# EAGLE design nanoController (EAGLE 9.6.1)
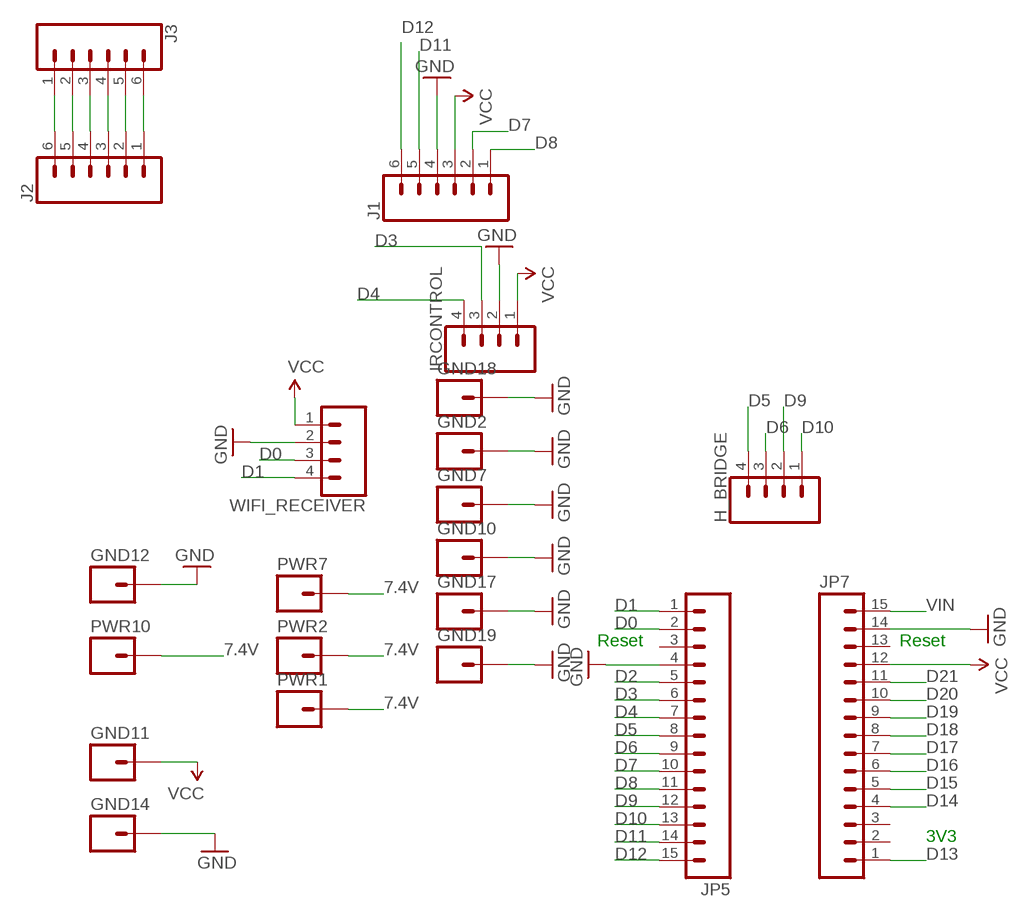
[diagram p0: schematic, sheet 1]

## Parts
GND2  M01PTH_LONGPAD  [1X01_LONGPAD]
GND7  M01PTH_LONGPAD  [1X01_LONGPAD]
GND10  M01PTH_LONGPAD  [1X01_LONGPAD]
GND11  M01PTH_LONGPAD  [1X01_LONGPAD]
GND12  M01PTH_LONGPAD  [1X01_LONGPAD]
GND14  M01PTH_LONGPAD  [1X01_LONGPAD]
GND17  M01PTH_LONGPAD  [1X01_LONGPAD]
GND18  M01PTH_LONGPAD  [1X01_LONGPAD]
GND19  M01PTH_LONGPAD  [1X01_LONGPAD]
H_BRIDGE  CONN_04LONGPADS  [1X04_LONGPADS]
IRCONTROL  CONN_04LONGPADS  [1X04_LONGPADS]
J1  CONN_06SILK_FEMALE_PTH  [1X06]
J2  CONN_06SILK_FEMALE_PTH  [1X06]
J3  CONN_06SILK_FEMALE_PTH  [1X06]
JP5  M15  [1X15]
JP7  M15  [1X15]
PWR1  M01PTH_LONGPAD  [1X01_LONGPAD]
PWR2  M01PTH_LONGPAD  [1X01_LONGPAD]
PWR7  M01PTH_LONGPAD  [1X01_LONGPAD]
PWR10  M01PTH_LONGPAD  [1X01_LONGPAD]
WIFI_RECEIVER  CONN_04LONGPADS  [1X04_LONGPADS]

## Nets
7.4V: PWR1.1 PWR2.1 PWR7.1 PWR10.1
D0: JP5.2 WIFI_RECEIVER.3
D1: JP5.1 WIFI_RECEIVER.4
D2: JP5.5
D3: IRCONTROL.3 JP5.6
D4: IRCONTROL.4 JP5.7
D5: H_BRIDGE.4 JP5.8
D6: H_BRIDGE.3 JP5.9
D7: J1.2 JP5.10
D8: J1.1 JP5.11
D9: H_BRIDGE.2 JP5.12
D10: H_BRIDGE.1 JP5.13
D11: J1.5 JP5.14
D12: J1.6 JP5.15
D13: JP7.1
D14: JP7.4
D15: JP7.5
D16: JP7.6
D17: JP7.7
D18: JP7.8
D19: JP7.9
D20: JP7.10
D21: JP7.11
GND [gnd]: GND2.1 GND7.1 GND10.1 GND12.1 GND14.1 GND17.1 GND18.1 GND19.1 IRCONTROL.2 J1.4 JP5.4 JP7.14 WIFI_RECEIVER.2
N$1: J2.6 J3.1
N$2: J2.5 J3.2
N$3: J2.4 J3.3
N$4: J2.3 J3.4
N$5: J2.2 J3.5
N$6: J2.1 J3.6
VCC: GND11.1 IRCONTROL.1 J1.3 JP7.12 WIFI_RECEIVER.1
VIN: JP7.15
Unconnected: JP5.3 JP7.2 JP7.3 JP7.13

## Notes on the sheet
- Reset | Reset
- 3V3

## Library data of the parts
GND2 GND7 GND10-GND12 GND14 GND17-GND19 PWR1 PWR2 PWR7 PWR10 = SparkFun-Connectors:M01: Header 1 Standard 1-pin 0.1" header. Use with straight break away headers (SKU : PRT-00116), right angle break away headers (PRT-00553), swiss pins (PRT-00743), machine pins (PRT-00117), and female headers (PRT-00115).
H_BRIDGE IRCONTROL WIFI_RECEIVER = SparkFun-Connectors:CONN_04: Multi connection point. Often used as Generic Header-pin footprint for 0.1 inch spaced/style header connections On any of the 0.1 inch spaced packages, you can populate with these: Break Away Headers - Straight <https://www.sparkfun.com/products/116> (PRT-00116) Break Away Male Headers - Right Angle <https://www.sparkfun.com/products/553> (PRT-00553) Female Headers <https://www.sparkfun.com/products/115> (PRT-00115) Break Away Headers - Machine Pin <https://www.sparkfun.com/products/117> (PRT-00117) Break Away Female Headers - Swiss Machine Pin <https://www.sparkfun.com/products/743> (PRT-00743) For SCREWTERMINALS and SPRING TERMINALS visit here: Screw Terimnals on SparkFun.com <https://www.sparkfun.com/search/results?term=Screw+Terminals> (5mm/3.5mm/2.54mm spacing) This device is also useful as a general connection point to wire up your design to another part of your project. Our various solder wires solder well into these plated through hole pads. Hook-Up Wire - Assortment (Stranded, 22 AWG) <https://www.sparkfun.com/products/11375> (PRT-11375) Hook-Up Wire - Assortment (Solid Core, 22 AWG) <https://www.sparkfun.com/products/11367> (PRT-11367) View the entire wire category on our website here <https://www.sparkfun.com/categories/141> Special notes: Molex polarized connector foot print use with SKU : PRT-08231 with associated crimp pins and housings. 1MM SMD Version SKU: PRT-10208; PROD_ID: CONN-09696
J1-J3 = SparkFun-Connectors:CONN_06: Multi connection point. Often used as Generic Header-pin footprint for 0.1 inch spaced/style header connections On any of the 0.1 inch spaced packages, you can populate with these: Break Away Headers - Straight <https://www.sparkfun.com/products/116> (PRT-00116) Break Away Male Headers - Right Angle <https://www.sparkfun.com/products/553> (PRT-00553) Female Headers <https://www.sparkfun.com/products/115> (PRT-00115) Break Away Headers - Machine Pin <https://www.sparkfun.com/products/117> (PRT-00117) Break Away Female Headers - Swiss Machine Pin <https://www.sparkfun.com/products/743> (PRT-00743) Arduino Stackable Header - 6 Pin <https://www.sparkfun.com/products/9280> (PRT-09280) For SCREWTERMINALS and SPRING TERMINALS visit here: Screw Terimnals on SparkFun.com <https://www.sparkfun.com/search/results?term=Screw+Terminals> (5mm/3.5mm/2.54mm spacing) This device is also useful as a general connection point to wire up your design to another part of your project. Our various solder wires solder well into these plated through hole pads. Hook-Up Wire - Assortment (Stranded, 22 AWG) <https://www.sparkfun.com/products/11375> (PRT-11375) Hook-Up Wire - Assortment (Solid Core, 22 AWG) <https://www.sparkfun.com/products/11367> (PRT-11367) View the entire wire category on our website here <https://www.sparkfun.com/categories/141>; PROD_ID: CONN-08437
JP5 JP7 = SparkFun-Connectors:M15: Header 15 Standard 15-pin 0.1" header. Use with straight break away headers (SKU : PRT-00116), right angle break away headers (PRT-00553), swiss pins (PRT-00743), machine pins (PRT-00117), and female headers (PRT-00115).

## Net classes
0 default: width 0.254 mm, clearance 0.254 mm
1 power: width 0.61 mm, drill 0.711 mm, clearance 0.33 mm
2 gnd: width 0.305 mm, drill 0.711 mm, clearance 0.254 mm
3 usbvcc: width 0.508 mm, drill 0.711 mm, clearance 0.254 mm
4 aref: width 0.406 mm

## Board
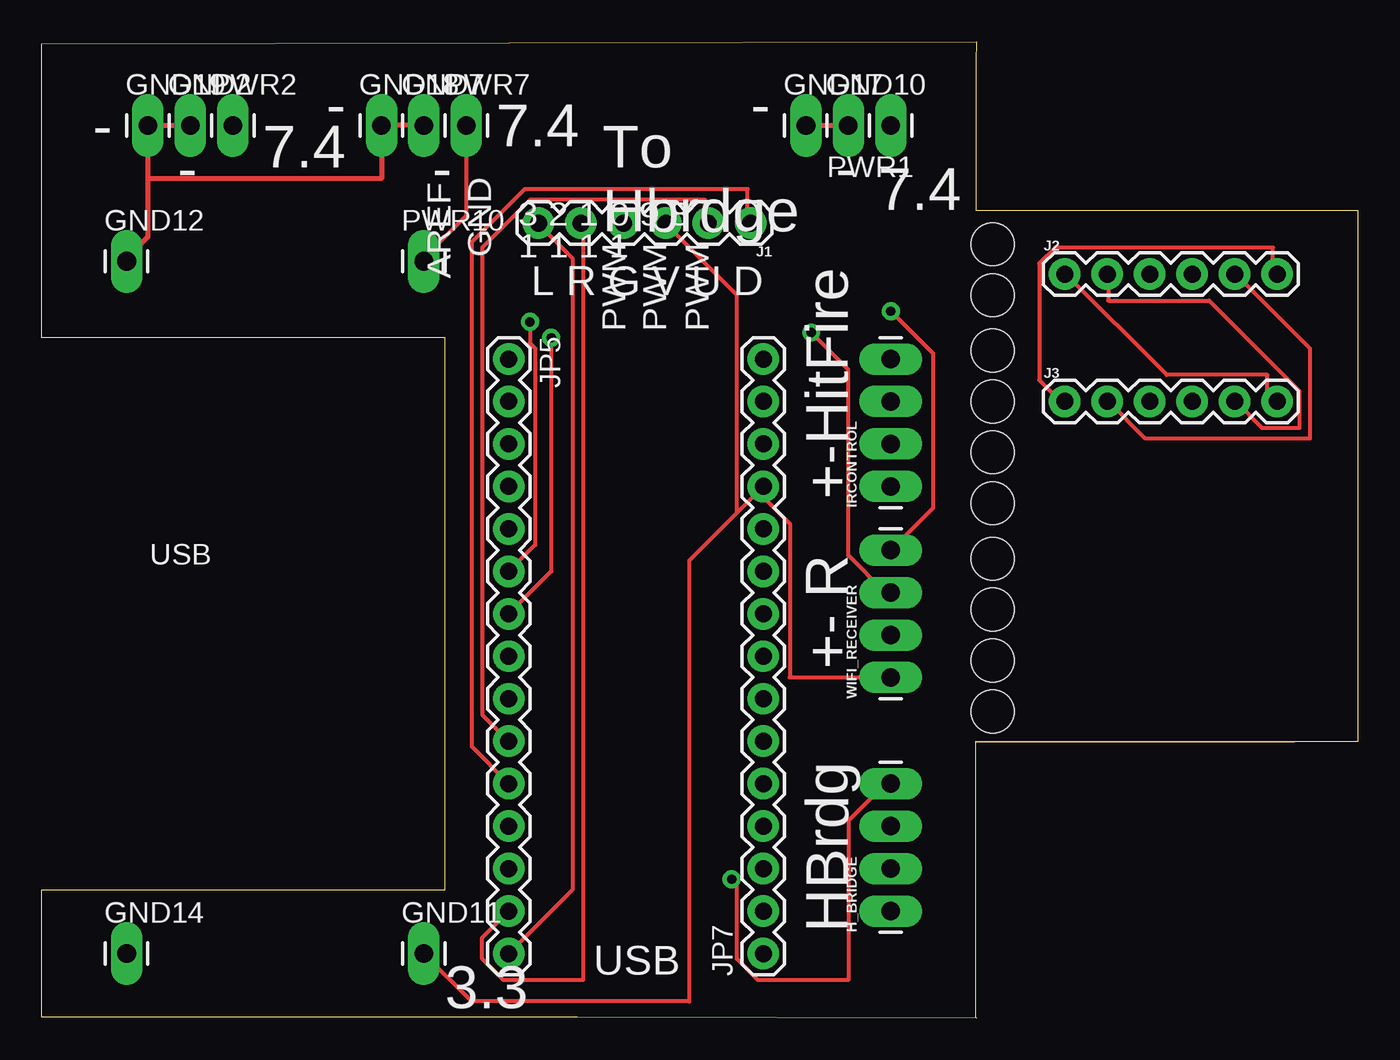
[diagram p1: board, top side]
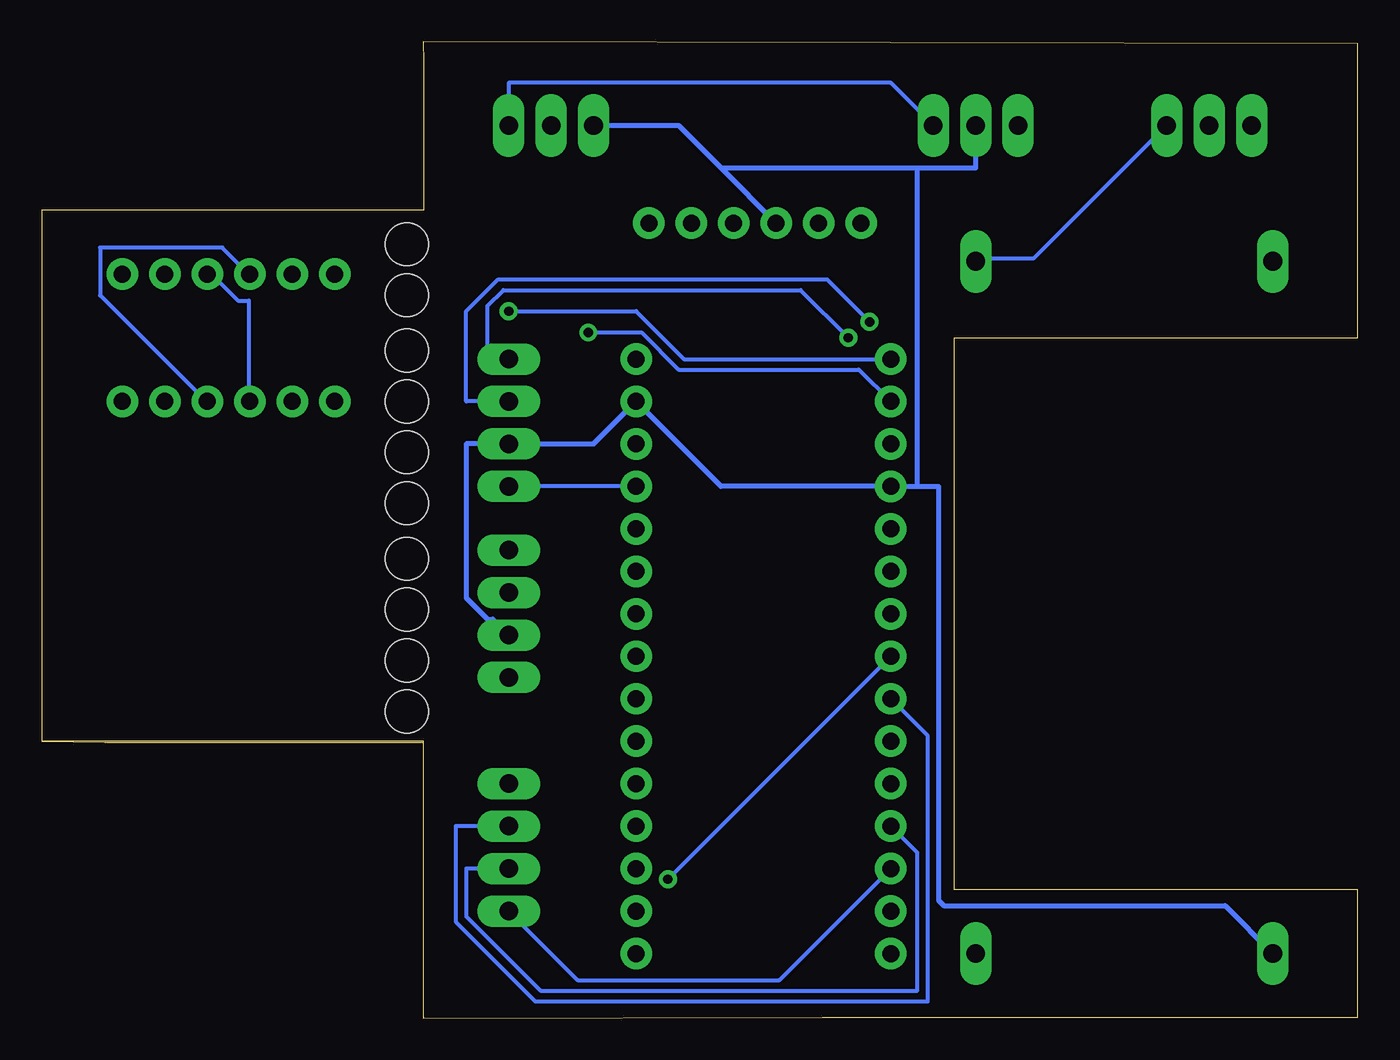
[diagram p2: board, bottom side, seen from below]

Size 78.74 x 58.39 mm. Coordinates in mm from the lower left corner, seen from the top.
Outline: 78.74,16.56 78.74,48.31 55.88,48.31 55.88,57.2 55.93,58.39 0,58.27 0,40.69 24.13,40.69 24.13,7.67 0,7.67 0,0.05 32.03,0.05 55.93,0 55.88,0.05 55.88,16.56
Outline: 55.88,16.56 78.74,16.56
Outline: 78.74,16.56 74.98,16.51 55.93,16.51 55.88,16.56
Copper layers (1*16): Top 0.035mm / dielectric 1.5mm / Bottom 0.035mm
Design rules "default": minimum track width 10mil, minimum drill 22mil, track to track 10mil, track to pad 10mil, pad to pad 10mil, via to via 16mil, smd to smd 8mil, copper to edge 30mil, drill to drill 12mil, minimum pad ring 10mil, minimum via ring 10mil, stop-mask expansion 4mil, vias tented up to drill 0mil, thermal gap 10mil
Holes 2.54 mm at 56.9,46.28 56.9,43.23 56.9,39.93 56.9,36.88 56.9,33.83 56.9,30.78 56.9,27.48 56.9,24.43 56.9,21.39 56.9,18.34
vRestrict: area 25.4,45.5 to 27.1,49.2; area 33.4,41.1 to 34.9,44.6; area 35.9,41.1 to 37.5,44.6; area 38.5,41.1 to 40,44.6; area 42.5,38.7 to 43.1,38.9

### Footprints (pad centres in the part's own frame; a part is rotated, then mirrored left to right if it is on the bottom)
1X01_LONGPAD = drill 1.118 pad 1.88 long: 1 0,0
1X04_LONGPADS = drill 1.118 pad 1.88 long: 1 0,0; 2 2.54,0; 3 5.08,0; 4 7.62,0
1X06 = drill 1.016 pad 1.88: 1 0,0; 2 2.54,0; 3 5.08,0; 4 7.62,0; 5 10.16,0; 6 12.7,0
1X15 = drill 1.016 pad 1.88: 1 0,0; 2 2.54,0; 3 5.08,0; 4 7.62,0; 5 10.16,0; 6 12.7,0; 7 15.24,0; 8 17.78,0; 9 20.32,0; 10 22.86,0; 11 25.4,0; 12 27.94,0; 13 30.48,0; 14 33.02,0; 15 35.56,0

### Placement (x,y rotation side)
GND2  8.89,53.39 0 top
GND7  22.86,53.39 0 top
GND10  48.26,53.39 0 top
GND11  22.86,3.86 0 top
GND12  5.08,45.26 0 top
GND14  5.08,3.86 0 top
GND17  45.72,53.39 0 top
GND18  20.32,53.39 0 top
GND19  6.35,53.39 0 top
H_BRIDGE  50.8,6.4 90 top
IRCONTROL  50.8,31.8 90 top
J1  42.42,47.55 180 top
J2  61.21,44.5 0 top
J3  61.21,36.88 0 top
JP5  27.94,39.42 270 top
JP7  43.18,3.86 90 top
PWR1  50.8,53.39 180 top
PWR2  11.43,53.39 0 top
PWR7  25.4,53.39 0 top
PWR10  22.86,45.26 0 top
WIFI_RECEIVER  50.8,20.37 90 top

### Tracks (layer width: path | path; a pad name or v marks a point on that pad's centre or on a via)
7.4V
  Top 0.254: PWR7.1 25.4,47.99 22.86,45.45 PWR10.1
  Bottom 0.254: PWR2.1 19.37,45.45 22.86,45.45 PWR10.1 | PWR1.1 50.8,55.93 27.94,55.93 PWR7.1
D0  (via drill 0.56)
  Top 0.254: v46.04,41.01 48.26,38.79 48.26,27.67 50.48,25.45 WIFI_RECEIVER.3
  Bottom 0.254: JP5.2 29.84,38.79 40.64,38.79 42.86,41.01 v46.04,41.01
D1  (via drill 0.56)
  Top 0.254: v50.8,42.28 53.34,39.74 53.34,30.53 WIFI_RECEIVER.4
  Bottom 0.254: JP5.1 40.32,39.42 43.18,42.28 v50.8,42.28
D3  (via drill 0.56)
  Top 0.254: JP5.6 29.53,28.31 29.53,40.06 29.21,40.37 v29.21,41.64
  Bottom 0.254: v29.21,41.64 31.75,44.18 51.44,44.18 53.34,42.28 53.34,36.88 IRCONTROL.3
D4  (via drill 0.56)
  Top 0.254: JP5.7 30.48,26.72 v30.48,40.69
  Bottom 0.254: v30.48,40.69 33.34,43.55 51.12,43.55 52.07,42.6 52.07,39.42 IRCONTROL.4
D5  (via drill 0.56)
  Top 0.254: v41.27,8.31 41.59,7.99 41.59,3.54 42.86,2.27 48.26,2.27 48.26,11.8 50.48,14.02 H_BRIDGE.4
  Bottom 0.254: v41.27,8.31 JP5.8
D6
  Bottom 0.254: JP5.9 25.72,16.88 25.72,1 49.21,1 53.98,5.77 53.98,11.48 H_BRIDGE.3
D7
  Top 0.254: JP5.10 26.35,18.15 26.35,46.09 29.21,48.95 39.69,48.95 39.69,47.68 J1.2
D8
  Top 0.254: JP5.11 25.72,16.24 25.72,46.41 28.89,49.58 42.23,49.58 42.23,47.68 J1.1
D9
  Bottom 0.254: JP5.12 26.35,9.89 26.35,1.64 48.9,1.64 53.34,6.08 53.34,8.94 H_BRIDGE.2
D10
  Bottom 0.254: JP5.13 34.61,2.27 46.67,2.27 H_BRIDGE.1
D11
  Top 0.254: JP5.14 26.35,4.81 26.35,3.54 27.62,2.27 32.38,2.27 32.38,47.36 J1.5
D12
  Top 0.254: JP5.15 31.75,7.67 31.75,45.45 29.84,47.36 J1.6
GND
  Top 0.305: 6.35,50.22 GND19.1 GND2.1 | 6.35,50.22 6.35,46.72 5.08,45.45 GND12.1 | GND7.1 GND18.1 20.32,50.22 6.35,50.22 | GND17.1 GND10.1
  Bottom 0.305: 38.1,50.85 40.64,53.39 GND17.1 | 38.1,50.85 J1.4 | GND7.1 22.86,50.85 26.35,50.85 | 38.1,50.85 26.35,50.85 | WIFI_RECEIVER.2 51.75,23.86 52.07,23.86 53.34,25.13 53.34,34.34 IRCONTROL.2 45.72,34.34 JP7.14 38.1,31.8 JP5.4 26.35,31.8 | GND14.1 7.94,6.72 24.77,6.72 25.08,7.04 25.08,31.8 26.35,31.8 | 26.35,31.8 26.35,50.85
N$1
  Top 0.254: J3.1 60.96,36.88 59.69,38.15 59.69,45.14 60.64,46.09 73.66,46.09 73.66,44.5 J2.6
N$2
  Top 0.254: J3.2 63.82,36.88 66.04,34.66 75.88,34.66 75.88,40.06 71.44,44.5 J2.5
N$3
  Bottom 0.254: J3.3 66.36,36.88 66.36,42.91 66.99,42.91 68.58,44.5 J2.4
N$4
  Bottom 0.254: J3.4 68.9,36.88 75.25,43.23 75.25,46.09 67.94,46.09 66.36,44.5 J2.3
N$5
  Top 0.254: J3.5 71.44,36.88 73.03,35.29 75.25,35.29 75.25,37.52 69.85,42.91 63.82,42.91 63.82,44.5 J2.2
N$6
  Top 0.254: J2.1 61.28,44.5 67.31,38.47 73.34,38.47 73.34,37.2 73.66,36.88 J3.6
VCC
  Top 0.254: GND11.1 25.72,1 38.73,1 38.73,27.36 41.59,30.21 | 42.86,31.48 41.59,30.21 | 41.59,30.21 41.59,43.23 37.47,47.36 J1.3 | WIFI_RECEIVER.1 44.77,20.37 44.77,29.58 42.86,31.48 | 42.86,31.48 JP7.12
  Bottom 0.254: JP7.12 IRCONTROL.1

### Text on the board
tNames: 3 2 1 0 9 8 | GND | 1 1 1 1 | AREF | PWM | PWM | PWM | USB
Reference: C8 | C2 | R11 | C4 | C5
_tsilk: - | - | - | 7.4 | 7.4 | - | - | - | 7.4 | To / Hbrdge | L R G V U D | +-HitFire | +- R | HBrdg | USB | 3.3